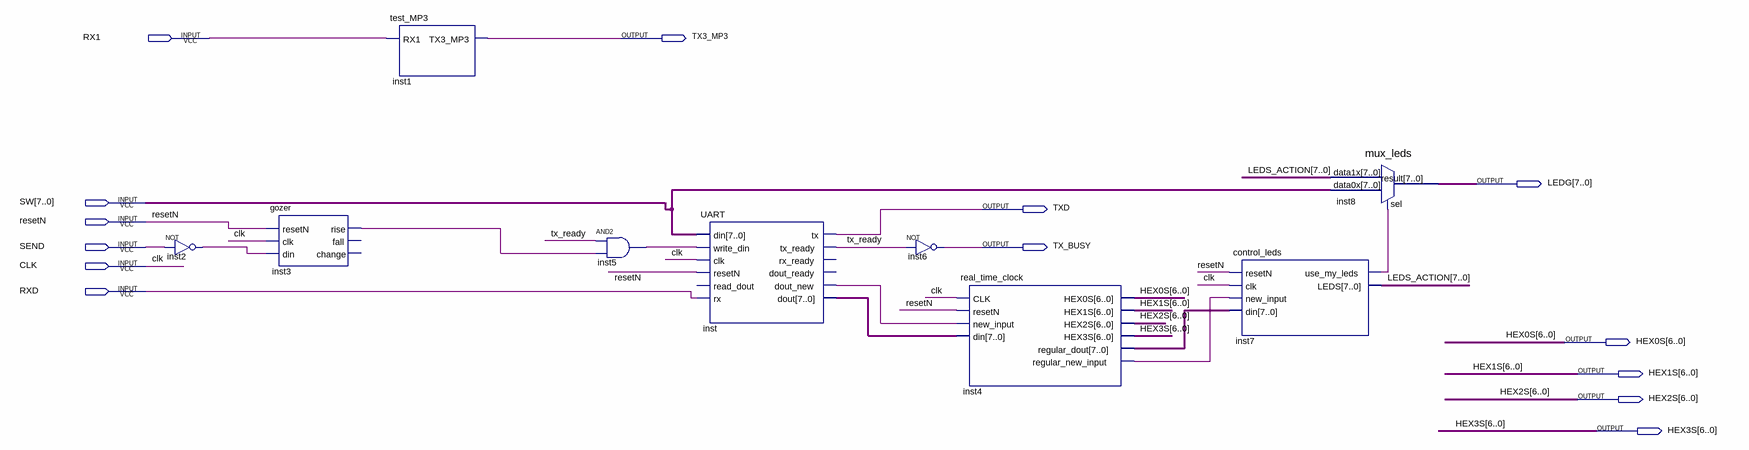
[diagram p0: schematic sheet]
// Quartus schematic Main.bdf as structural Verilog: 9 symbols, 14 pins
module Main (
  input  RX1,
  input  [7:0] SW,
  input  resetN,
  input  SEND,
  input  CLK,
  input  RXD,
  output TX3_MP3,
  output [7:0] LEDG,
  output TXD,
  output TX_BUSY,
  output [6:0] HEX0S,
  output [6:0] HEX1S,
  output [6:0] HEX2S,
  output [6:0] HEX3S
);

  wire inst2_out, inst3_rise, inst4_regular_new_input, inst5_out, inst7_use_my_leds, inst_dout_new, tx_ready;
  wire [7:0] inst4_regular_dout, inst_dout, LEDS_ACTION;

  not inst2 (inst2_out, SEND);
  gozer inst3 (.resetN(resetN), .clk(CLK), .din(inst2_out), .rise(inst3_rise));  // open: fall, change
  test_MP3 inst1 (.RX1(RX1), .TX3_MP3(TX3_MP3));
  and inst5 (inst5_out, tx_ready, inst3_rise);
  UART inst (
    .din(SW), .write_din(inst5_out), .clk(CLK), .resetN(resetN), .rx(RXD), .tx(TXD), .tx_ready(tx_ready),
    .dout_new(inst_dout_new), .dout(inst_dout));  // open: read_dout, rx_ready, dout_ready
  not inst6 (TX_BUSY, tx_ready);
  real_time_clock inst4 (
    .CLK(CLK), .resetN(resetN), .new_input(inst_dout_new), .din(inst_dout), .HEX0S(HEX0S), .HEX1S(HEX1S),
    .HEX2S(HEX2S), .HEX3S(HEX3S), .regular_dout(inst4_regular_dout),
    .regular_new_input(inst4_regular_new_input));
  control_leds inst7 (
    .resetN(resetN), .clk(CLK), .new_input(inst4_regular_new_input), .din(inst4_regular_dout),
    .use_my_leds(inst7_use_my_leds), .LEDS(LEDS_ACTION));
  mux_leds inst8 (.data1x(LEDS_ACTION), .data0x(SW), .sel(inst7_use_my_leds), .result(LEDG));
endmodule
